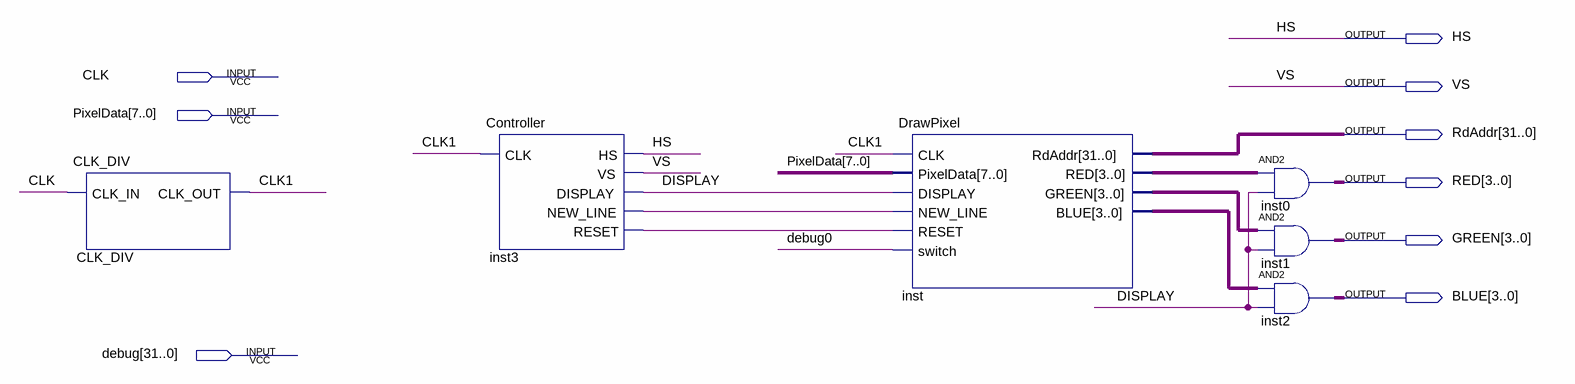
[diagram p0: schematic sheet]
// Quartus schematic GPU.bdf as structural Verilog: 6 symbols, 9 pins
module GPU (
  input  CLK,
  input  [7:0] PixelData,
  input  [31:0] debug,
  output HS,
  output VS,
  output [31:0] RdAddr,
  output [3:0] RED,
  output [3:0] GREEN,
  output [3:0] BLUE
);

  wire CLK1, DISPLAY, inst3_new_line, inst3_reset;
  wire [3:0] inst_blue, inst_green, inst_red;

  CLK_DIV CLK_DIV (.CLK_IN(CLK), .CLK_OUT(CLK1));
  Controller inst3 (.CLK(CLK1), .HS(HS), .VS(VS), .DISPLAY(DISPLAY), .NEW_LINE(inst3_new_line), .RESET(inst3_reset));
  DrawPixel inst (
    .CLK(CLK1), .PixelData(PixelData), .DISPLAY(DISPLAY), .NEW_LINE(inst3_new_line), .RESET(inst3_reset),
    .switch(debug[0]), .RdAddr(RdAddr), .RED(inst_red), .GREEN(inst_green), .BLUE(inst_blue));
  assign RED = inst_red & {4{DISPLAY}};  // AND2 inst0, 4 bits wide
  assign GREEN = inst_green & {4{DISPLAY}};  // AND2 inst1, 4 bits wide
  assign BLUE = inst_blue & {4{DISPLAY}};  // AND2 inst2, 4 bits wide
endmodule
